# EAGLE design M90E36A (EAGLE 9.6.2)

## Sheet 1 of 2: Main
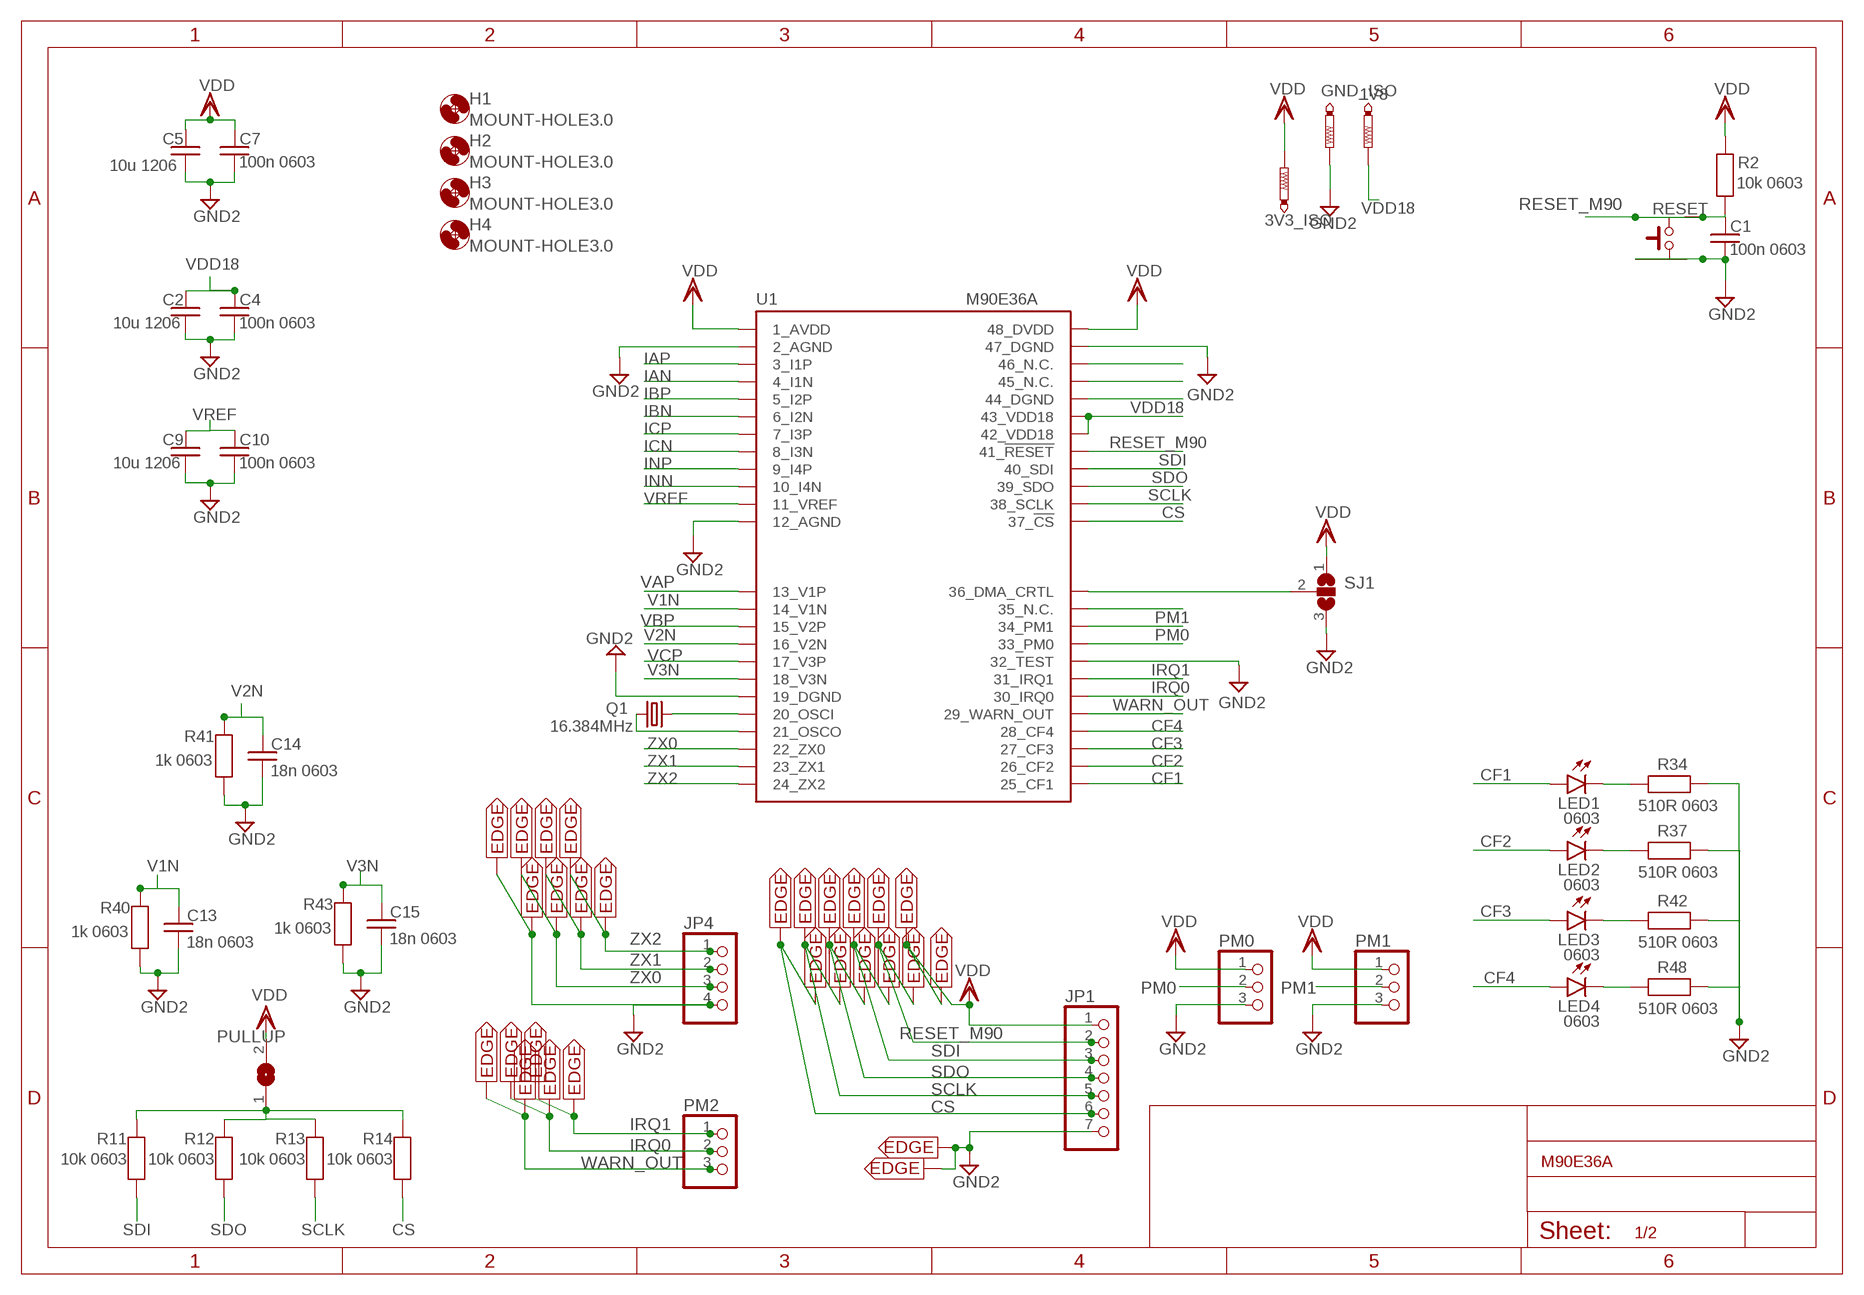
[diagram p0: schematic, sheet 1]

### Parts
1V8  PTR1TP19R  [TP19R]
3V3_ISO  PTR1TP19R  [TP19R]
C1  100n 0603  C0603  [0603_IMPERIAL]
C2  10u 1206  C1206  [1206_IMPERIAL]
C4  100n 0603  C0603  [0603_IMPERIAL]
C5  10u 1206  C1206  [1206_IMPERIAL]
C7  100n 0603  C0603  [0603_IMPERIAL]
C9  10u 1206  C1206  [1206_IMPERIAL]
C10  100n 0603  C0603  [0603_IMPERIAL]
C13  18n 0603  C0603  [0603_IMPERIAL]
C14  18n 0603  C0603  [0603_IMPERIAL]
C15  18n 0603  C0603  [0603_IMPERIAL]
GND_ISO  PTR1TP19R  [TP19R]
H1  MOUNT-HOLE3.0  [3,0]
H2  MOUNT-HOLE3.0  [3,0]
H3  MOUNT-HOLE3.0  [3,0]
H4  MOUNT-HOLE3.0  [3,0]
JP1  PINHD-1X7  [1X07]
JP4  PINHD-1X4  [1X04]
LED1  0603  LEDCHIPLED_0805  [CHIPLED_0805]
LED2  0603  LEDCHIPLED_0805  [CHIPLED_0805]
LED3  0603  LEDCHIPLED_0805  [CHIPLED_0805]
LED4  0603  LEDCHIPLED_0805  [CHIPLED_0805]
PM0  PINHD-1X3  [1X03]
PM1  PINHD-1X3  [1X03]
PM2  PINHD-1X3  [1X03]
PULLUP  SJ  [SJ]
Q1  16.384MHz  CRYSTALHC49UP  [HC49UP]
R2  10k 0603  R0603  [0603_IMPERIAL]
R11  10k 0603  R0603  [0603_IMPERIAL]
R12  10k 0603  R0603  [0603_IMPERIAL]
R13  10k 0603  R0603  [0603_IMPERIAL]
R14  10k 0603  R0603  [0603_IMPERIAL]
R34  510R 0603  R0603  [0603_IMPERIAL]
R37  510R 0603  R0603  [0603_IMPERIAL]
R40  1k 0603  R0603  [0603_IMPERIAL]
R41  1k 0603  R0603  [0603_IMPERIAL]
R42  510R 0603  R0603  [0603_IMPERIAL]
R43  1k 0603  R0603  [0603_IMPERIAL]
R48  510R 0603  R0603  [0603_IMPERIAL]
RESET  TACTILE_SWITCHPTH  [TACTILE_SWITCH_PTH]
SJ1  SJ2W  [SJ_2]
U1  M90E36A  [TQFP-48]
U$1  EDGE  [EDGE]
U$2  EDGE  [EDGE]
U$3  EDGE  [EDGE]
U$4  EDGE  [EDGE]
U$5  EDGE  [EDGE]
U$6  EDGE  [EDGE]
U$7  EDGE  [EDGE]
U$8  EDGE  [EDGE]
U$9  EDGE  [EDGE]
U$10  EDGE  [EDGE]
U$11  EDGE  [EDGE]
U$12  EDGE  [EDGE]
U$13  EDGE  [EDGE]
U$14  EDGE  [EDGE]
U$15  EDGE  [EDGE]
U$16  EDGE  [EDGE]
U$17  EDGE  [EDGE]
U$18  EDGE  [EDGE]
U$19  EDGE  [EDGE]
U$20  EDGE  [EDGE]
U$21  EDGE  [EDGE]
U$22  EDGE  [EDGE]
U$23  EDGE  [EDGE]
U$24  EDGE  [EDGE]
U$25  EDGE  [EDGE]
U$26  EDGE  [EDGE]
U$27  EDGE  [EDGE]
U$28  EDGE  [EDGE]

### Nets
CF1: LED1.A U1.P$25(25_CF1)
CF2: LED2.A U1.P$26(26_CF2)
CF3: LED3.A U1.P$27(27_CF3)
CF4: LED4.A U1.P$28(28_CF4)
CS: JP1.6 R14.P$1 U1.P$37(37_!CS) U$4.P$1 U$25.P$1
GND2: C1.P$1 C2.P$1 C4.P$1 C5.P$1 C7.P$1 C9.P$1 C10.P$1 C13.P$1 C14.P$1 C15.P$1 GND_ISO.TP JP1.7 JP4.4 PM0.3 PM1.3 R34.P$2 R37.P$2 R40.P$1 R41.P$1 R42.P$2 R43.P$1 R48.P$2 RESET.P$1 RESET.P$2 SJ1.3 U1.P$2(2_AGND) U1.P$12(12_AGND) U1.P$19(19_DGND) U1.P$32(32_TEST) U1.P$47(47_DGND) U$6.P$1 U$10.P$1 U$18.P$1 U$28.P$1 ; also sheet 2
IAN: U1.P$4(4_I1N) ; also sheet 2
IAP: U1.P$3(3_I1P) ; also sheet 2
IBN: U1.P$6(6_I2N) ; also sheet 2
IBP: U1.P$5(5_I2P) ; also sheet 2
ICN: U1.P$8(8_I3N) ; also sheet 2
ICP: U1.P$7(7_I3P) ; also sheet 2
INN: U1.P$10(10_I4N) ; also sheet 2
INP: U1.P$9(9_I4P) ; also sheet 2
IRQ0: PM2.2 U1.P$30(30_IRQ0) U$12.P$1 U$20.P$1
IRQ1: PM2.1 U1.P$31(31_IRQ1) U$11.P$1 U$19.P$1
N$1: LED1.C R34.P$1
N$2: LED2.C R37.P$1
N$3: LED3.C R42.P$1
N$4: LED4.C R48.P$1
N$5: Q1.2 U1.P$20(20_OSCI)
N$6: Q1.1 U1.P$21(21_OSCO)
N$9: PULLUP.1 R11.P$2 R12.P$2 R13.P$2 R14.P$2
N$10: SJ1.2 U1.P$36(36_DMA_CRTL)
N$18: U1.P$46(46_N.C.)
N$19: U1.P$44(44_DGND)
N$25: U1.P$45(45_N.C.)
N$32: U1.P$35(35_N.C.)
PM0: PM0.2 U1.P$33(33_PM0)
PM1: PM1.2 U1.P$34(34_PM1)
RESET_M90: C1.P$2 JP1.2 R2.P$1 RESET.P$3 RESET.P$4 U1.P$41(41_!RESET) U$14.P$1 U$27.P$1
SCLK: JP1.5 R13.P$1 U1.P$38(38_SCLK) U$3.P$1 U$24.P$1
SDI: JP1.3 R11.P$1 U1.P$40(40_SDI) U$1.P$1 U$22.P$1
SDO: JP1.4 R12.P$1 U1.P$39(39_SDO) U$2.P$1 U$23.P$1
V1N: C13.P$2 R40.P$2 U1.P$14(14_V1N)
V2N: C14.P$2 R41.P$2 U1.P$16(16_V2N)
V3N: C15.P$2 R43.P$2 U1.P$18(18_V3N)
VAP: U1.P$13(13_V1P) ; also sheet 2
VBP: U1.P$15(15_V2P) ; also sheet 2
VCP: U1.P$17(17_V3P) ; also sheet 2
VDD: 3V3_ISO.TP C5.P$2 C7.P$2 JP1.1 PM0.1 PM1.1 PULLUP.2 R2.P$2 SJ1.1 U1.P$1(1_AVDD) U1.P$48(48_DVDD) U$5.P$1 U$26.P$1 ; also sheet 2
VDD18: 1V8.TP C2.P$2 C4.P$2 U1.P$42(42_VDD18) U1.P$43(43_VDD18)
VREF: C9.P$2 C10.P$2 U1.P$11(11_VREF)
WARN_OUT: PM2.3 U1.P$29(29_WARN_OUT) U$13.P$1 U$21.P$1
ZX0: JP4.3 U1.P$22(22_ZX0) U$9.P$1 U$17.P$1
ZX1: JP4.2 U1.P$23(23_ZX1) U$8.P$1 U$16.P$1
ZX2: JP4.1 U1.P$24(24_ZX2) U$7.P$1 U$15.P$1

## Sheet 2 of 2: Connectors
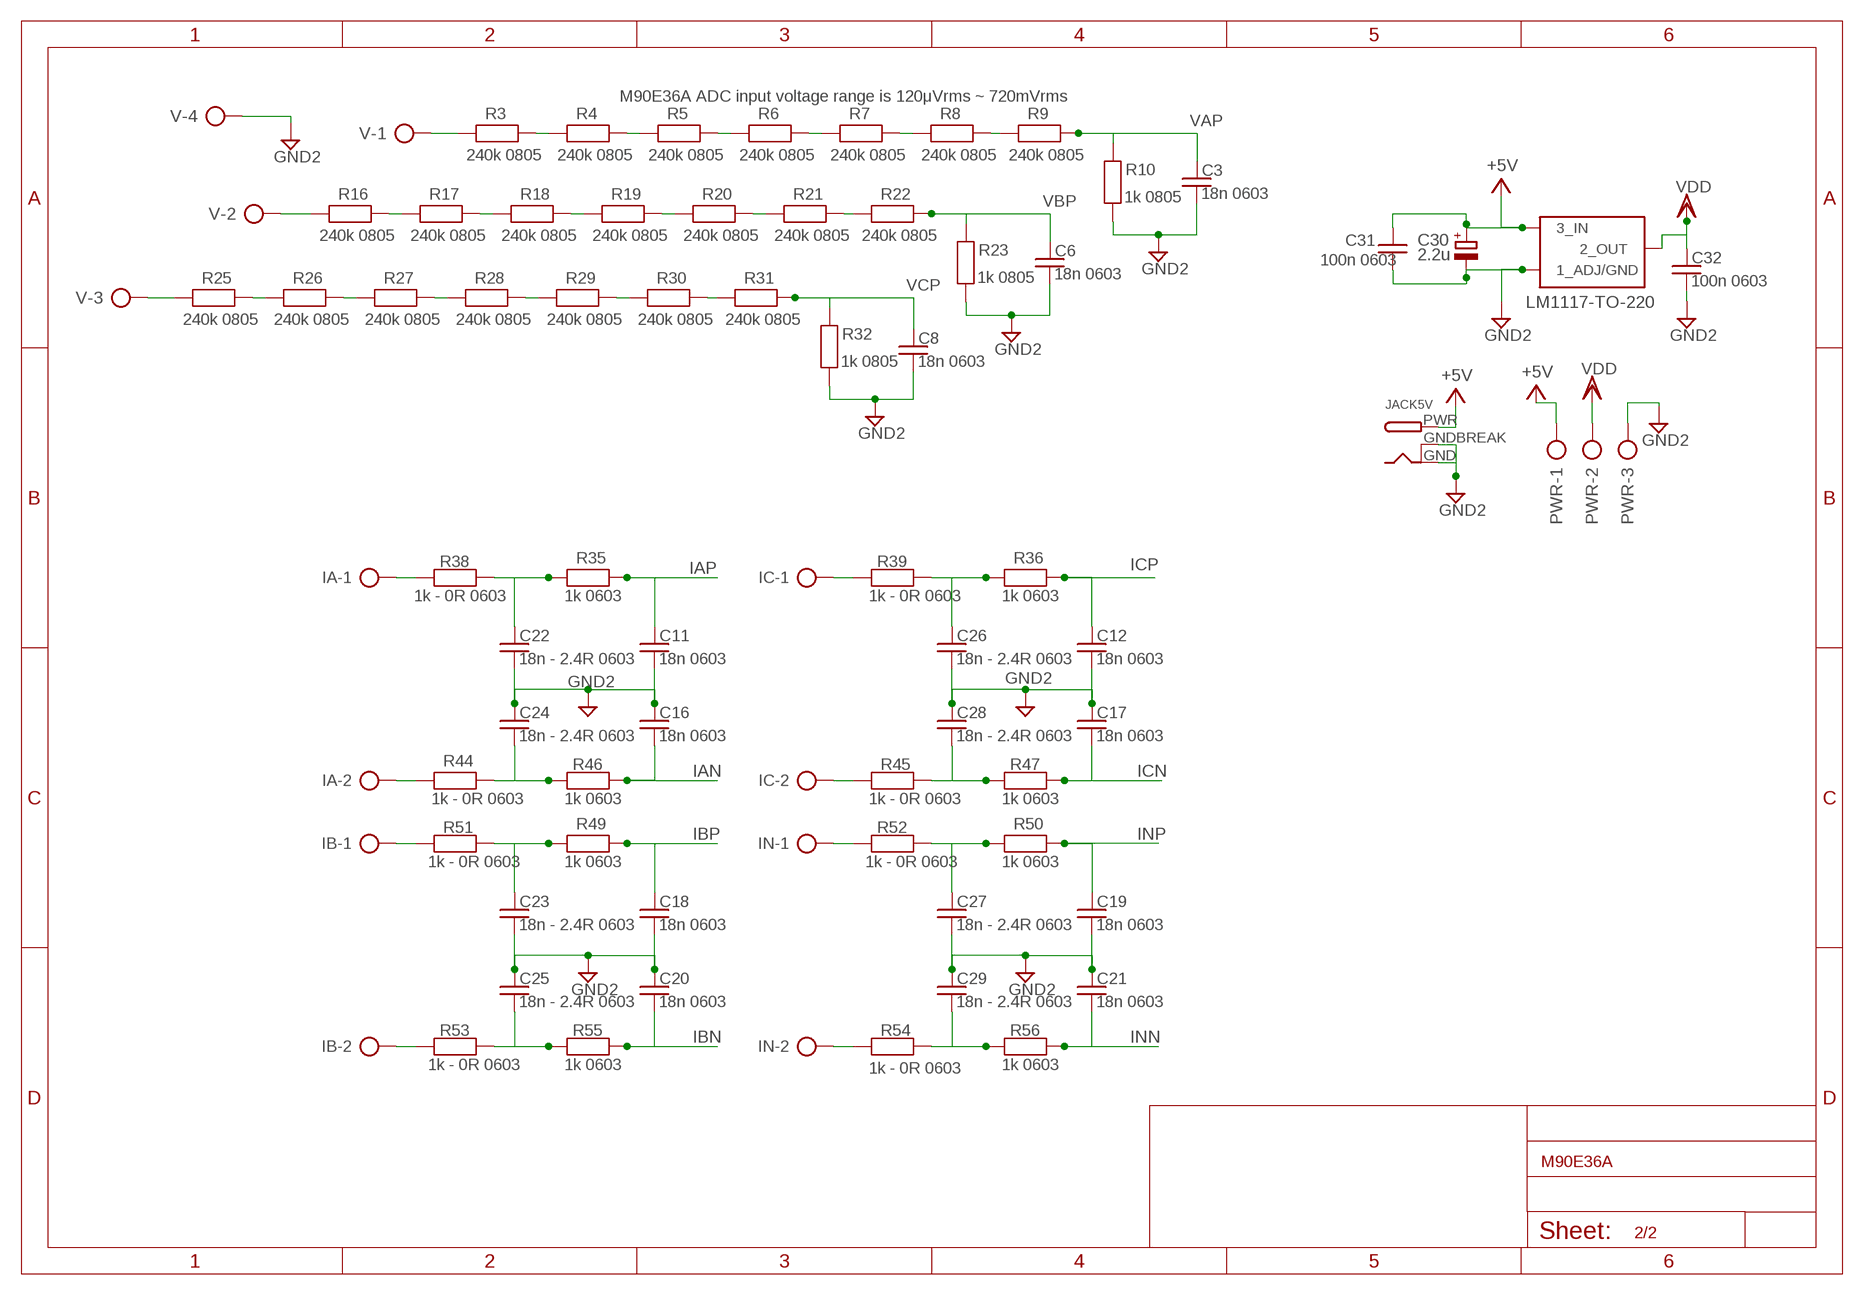
[diagram p1: schematic, sheet 2]

### Parts
C3  18n 0603  C0603  [0603_IMPERIAL]
C6  18n 0603  C0603  [0603_IMPERIAL]
C8  18n 0603  C0603  [0603_IMPERIAL]
C11  18n 0603  C0603  [0603_IMPERIAL]
C12  18n 0603  C0603  [0603_IMPERIAL]
C16  18n 0603  C0603  [0603_IMPERIAL]
C17  18n 0603  C0603  [0603_IMPERIAL]
C18  18n 0603  C0603  [0603_IMPERIAL]
C19  18n 0603  C0603  [0603_IMPERIAL]
C20  18n 0603  C0603  [0603_IMPERIAL]
C21  18n 0603  C0603  [0603_IMPERIAL]
C22  18n - 2.4R 0603  C0603  [0603_IMPERIAL]
C23  18n - 2.4R 0603  C0603  [0603_IMPERIAL]
C24  18n - 2.4R 0603  C0603  [0603_IMPERIAL]
C25  18n - 2.4R 0603  C0603  [0603_IMPERIAL]
C26  18n - 2.4R 0603  C0603  [0603_IMPERIAL]
C27  18n - 2.4R 0603  C0603  [0603_IMPERIAL]
C28  18n - 2.4R 0603  C0603  [0603_IMPERIAL]
C29  18n - 2.4R 0603  C0603  [0603_IMPERIAL]
C30  2.2u  CPOL-EUE2.5-5  [E2,5-5]
C31  100n 0603  C0603  [0603_IMPERIAL]
C32  100n 0603  C0603  [0603_IMPERIAL]
IA  AK500/2  [AK500/2]
IB  AK500/2  [AK500/2]
IC  AK500/2  [AK500/2]
IN  AK500/2  [AK500/2]
JACK5V  DCBARRELPTH  [DCJACK_2MM_PTH]
PWR  AK500/3  [AK500/3]
R3  240k 0805  R0805  [0805_IMPERIAL]
R4  240k 0805  R0805  [0805_IMPERIAL]
R5  240k 0805  R0805  [0805_IMPERIAL]
R6  240k 0805  R0805  [0805_IMPERIAL]
R7  240k 0805  R0805  [0805_IMPERIAL]
R8  240k 0805  R0805  [0805_IMPERIAL]
R9  240k 0805  R0805  [0805_IMPERIAL]
R10  1k 0805  R0805  [0805_IMPERIAL]
R16  240k 0805  R0805  [0805_IMPERIAL]
R17  240k 0805  R0805  [0805_IMPERIAL]
R18  240k 0805  R0805  [0805_IMPERIAL]
R19  240k 0805  R0805  [0805_IMPERIAL]
R20  240k 0805  R0805  [0805_IMPERIAL]
R21  240k 0805  R0805  [0805_IMPERIAL]
R22  240k 0805  R0805  [0805_IMPERIAL]
R23  1k 0805  R0805  [0805_IMPERIAL]
R25  240k 0805  R0805  [0805_IMPERIAL]
R26  240k 0805  R0805  [0805_IMPERIAL]
R27  240k 0805  R0805  [0805_IMPERIAL]
R28  240k 0805  R0805  [0805_IMPERIAL]
R29  240k 0805  R0805  [0805_IMPERIAL]
R30  240k 0805  R0805  [0805_IMPERIAL]
R31  240k 0805  R0805  [0805_IMPERIAL]
R32  1k 0805  R0805  [0805_IMPERIAL]
R35  1k 0603  R0603  [0603_IMPERIAL]
R36  1k 0603  R0603  [0603_IMPERIAL]
R38  1k - 0R 0603  R0603  [0603_IMPERIAL]
R39  1k - 0R 0603  R0603  [0603_IMPERIAL]
R44  1k - 0R 0603  R0603  [0603_IMPERIAL]
R45  1k - 0R 0603  R0603  [0603_IMPERIAL]
R46  1k 0603  R0603  [0603_IMPERIAL]
R47  1k 0603  R0603  [0603_IMPERIAL]
R49  1k 0603  R0603  [0603_IMPERIAL]
R50  1k 0603  R0603  [0603_IMPERIAL]
R51  1k - 0R 0603  R0603  [0603_IMPERIAL]
R52  1k - 0R 0603  R0603  [0603_IMPERIAL]
R53  1k - 0R 0603  R0603  [0603_IMPERIAL]
R54  1k - 0R 0603  R0603  [0603_IMPERIAL]
R55  1k 0603  R0603  [0603_IMPERIAL]
R56  1k 0603  R0603  [0603_IMPERIAL]
U3  LM1117-TO-220  [TO-220]
V  AK500/4  [AK500/4]

### Nets
+5V: C30.+ C31.P$2 JACK5V.PWR PWR.1 U3.3(3_IN)
GND2: C3.P$1 C6.P$1 C8.P$1 C11.P$1 C12.P$1 C16.P$2 C17.P$2 C18.P$1 C19.P$1 C20.P$2 C21.P$2 C22.P$1 C23.P$1 C24.P$2 C25.P$2 C26.P$1 C27.P$1 C28.P$2 C29.P$2 C30.- C31.P$1 C32.P$1 JACK5V.GND JACK5V.GNDBREAK PWR.3 R10.P$1 R23.P$1 R32.P$1 U3.1(1_ADJ/GND) V.4 ; also sheet 1
IAN: C16.P$1 R46.P$2 ; also sheet 1
IAP: C11.P$2 R35.P$2 ; also sheet 1
IBN: C20.P$1 R55.P$2 ; also sheet 1
IBP: C18.P$2 R49.P$2 ; also sheet 1
ICN: C17.P$1 R47.P$2 ; also sheet 1
ICP: C12.P$2 R36.P$2 ; also sheet 1
INN: C21.P$1 R56.P$2 ; also sheet 1
INP: C19.P$2 R50.P$2 ; also sheet 1
N$7: R3.P$2 R4.P$1
N$8: R4.P$2 R5.P$1
N$12: R5.P$2 R6.P$1
N$13: R6.P$2 R7.P$1
N$14: R7.P$2 R8.P$1
N$15: R8.P$2 R9.P$1
N$16: R3.P$1 V.1
N$17: R16.P$2 R17.P$1
N$20: R17.P$2 R18.P$1
N$21: R18.P$2 R19.P$1
N$22: R19.P$2 R20.P$1
N$23: R20.P$2 R21.P$1
N$24: R21.P$2 R22.P$1
N$26: R25.P$2 R26.P$1
N$27: R26.P$2 R27.P$1
N$28: R27.P$2 R28.P$1
N$29: R28.P$2 R29.P$1
N$30: R29.P$2 R30.P$1
N$31: R30.P$2 R31.P$1
N$33: R16.P$1 V.2
N$34: R25.P$1 V.3
N$35: IA.2 R44.P$1
N$36: C24.P$1 R44.P$2 R46.P$1
N$37: IC.1 R39.P$1
N$38: C26.P$2 R36.P$1 R39.P$2
N$39: IA.1 R38.P$2
N$40: C22.P$2 R35.P$1 R38.P$1
N$41: IC.2 R45.P$2
N$42: C28.P$1 R45.P$1 R47.P$1
N$44: IB.1 R51.P$2
N$46: C23.P$2 R49.P$1 R51.P$1
N$48: IB.2 R53.P$2
N$49: C25.P$1 R53.P$1 R55.P$1
N$53: IN.1 R52.P$2
N$54: C27.P$2 R50.P$1 R52.P$1
N$56: IN.2 R54.P$2
N$57: C29.P$1 R54.P$1 R56.P$1
VAP: C3.P$2 R9.P$2 R10.P$2 ; also sheet 1
VBP: C6.P$2 R22.P$2 R23.P$2 ; also sheet 1
VCP: C8.P$2 R31.P$2 R32.P$2 ; also sheet 1
VDD: C32.P$2 PWR.2 U3.2(2_OUT) ; also sheet 1

### Notes on the sheet
- M90E36A ADC input voltage range is 120μVrms ~ 720mVrms

## Library data of the parts
1V8 3V3_ISO GND_ISO = testpad:PTR1: TEST PIN
C1 C3 C4 C6-C8 C10-C29 C31 C32 = IntegratedLibrarySENAI:C0603: Capacitor cerâmico SMD (C0603); TIPO: CAPACITOR
C2 C5 C9 = IntegratedLibrarySENAI:C1206: Capacitor SMD (C1206); TIPO: CAPACITOR
C30 = rcl:CPOL-EU: POLARIZED CAPACITOR, European symbol; SPICEPREFIX: C
H1-H4 = holes:MOUNT-HOLE: MOUNTING HOLE with drill center marker
IA IB IC IN = con-ptr500:AK500/2: CONNECTOR; OC_FARNELL: unknown; OC_NEWARK: unknown
JACK5V = adafruit:DCBARREL: 2.0mm DC Barrel Jack DCJACK_2MM_PTH - Through Hole Jack (4UConnector: 05537)
JP1 = pinhead:PINHD-1X7: PIN HEADER
JP4 = pinhead:PINHD-1X4: PIN HEADER
LED1-LED4 = led:LED: LED OSRAM: - CHIPLED LG R971, LG N971, LY N971, LG Q971, LY Q971, LO R971, LY R971 LH N974, LH R974 LS Q976, LO Q976, LY Q976 LO Q996 - Hyper CHIPLED LW Q18S LB Q993, LB Q99A, LB R99A - SideLED LS A670, LO A670, LY A670, LG A670, LP A670 LB A673, LV A673, LT A673, LW A673 LH A674 LY A675 LS A676, LA A676, LO A676, LY A676, LW A676 LS A679, LY A679, LG A679 - Hyper Micro SIDELED® LS Y876, LA Y876, LO Y876, LY Y876 LT Y87S - SmartLED LW L88C, LW L88S LB L89C, LB L89S, LG L890 LS L89K, LO L89K, LY L89K LS L896, LA L896, LO L896, LY L896 - TOPLED LS T670, LO T670, LY T670, LG T670, LP T670 LSG T670, LSP T670, LSY T670, LOP T670, LYG T670 LG T671, LOG T671, LSG T671 LB T673, LV T673, LT T673, LW T673 LH T674 LS T676, LA T676, LO T676, LY T676, LB T676, LH T676, LSB T676, LW T676 LB T67C, LV T67C, LT T67C, LS T67K, LO T67K, LY T67K, LW E67C LS E67B, LA E67B, LO E67B, LY E67B, LB E67C, LV E67C, LT E67C LW T67C LS T679, LY T679, LG T679 LS T770, LO T770, LY T770, LG T770, LP T770 LB T773, LV T773, LT T773, LW T773 LH T774 LS E675, LA E675, LY E675, LS T675 LS T776, LA T776, LO T776, LY T776, LB T776 LHGB T686 LT T68C, LB T68C - Hyper Mini TOPLED® LB M676 - Mini TOPLED Santana® LG M470 LS M47K, LO M47K, LY M47K Source: http://www.osram.convergy.de LUXEON: - LUMILED® LXK2-PW12-R00, LXK2-PW12-S00, LXK2-PW14-U00, LXK2-PW14-V00 LXK2-PM12-R00, LXK2-PM12-S00, LXK2-PM14-U00 LXK2-PE12-Q00, LXK2-PE12-R00, LXK2-PE12-S00, LXK2-PE14-T00, LXK2-PE14-U00 LXK2-PB12-K00, LXK2-PB12-L00, LXK2-PB12-M00, LXK2-PB14-N00, LXK2-PB14-P00, LXK2-PB14-Q00 LXK2-PR12-L00, LXK2-PR12-M00, LXK2-PR14-Q00, LXK2-PR14-R00 LXK2-PD12-Q00, LXK2-PD12-R00, LXK2-PD12-S00 LXK2-PH12-R00, LXK2-PH12-S00 LXK2-PL12-P00, LXK2-PL12-Q00, LXK2-PL12-R00 Source: www.luxeon.com KINGBRIGHT: KA-3528ASYC Source: www.kingbright.com
PM0 PM1 PM2 = pinhead:PINHD-1X3: PIN HEADER
PULLUP = jumper:SJ: SMD solder JUMPER
PWR = con-ptr500:AK500/3: CONNECTOR; OC_FARNELL: unknown; OC_NEWARK: unknown
Q1 = crystal:CRYSTAL: CRYSTAL; OC_FARNELL: unknown; OC_NEWARK: unknown
R2 R11-R14 R34-R56 = IntegratedLibrarySENAI:R0603: Resistor SMD (R0603); TIPO: RESISTOR
R3-R10 R16-R23 R25-R32 = IntegratedLibrarySENAI:R0805: Resistor SMD R0805; TIPO: RESISTOR
RESET = IntegratedLibrarySENAI:TACTILE_SWITCH: Chave Tactil-Switch; FABRICANTE: METALTEX; PARTNUMBER: A06; TIPO: BOTAO
SJ1 = jumper:SJ2W: SMD solder JUMPER
U1 = IntegratedLibrarySENAI:M90E36A: Poly-Phase High-Performance Energy Metering IC (TQFP48); FABRICANTE: ATMEL; PARTNUMBER: ATM90E36A-AU-Y; TIPO: CIRCUITO INTEGRADO
U3 = IntegratedLibrarySENAI:LM1117-TO-220
U$1-U$28 = IntegratedLibrarySENAI:EDGE
V = con-ptr500:AK500/4: CONNECTOR; OC_FARNELL: unknown; OC_NEWARK: unknown

## Board
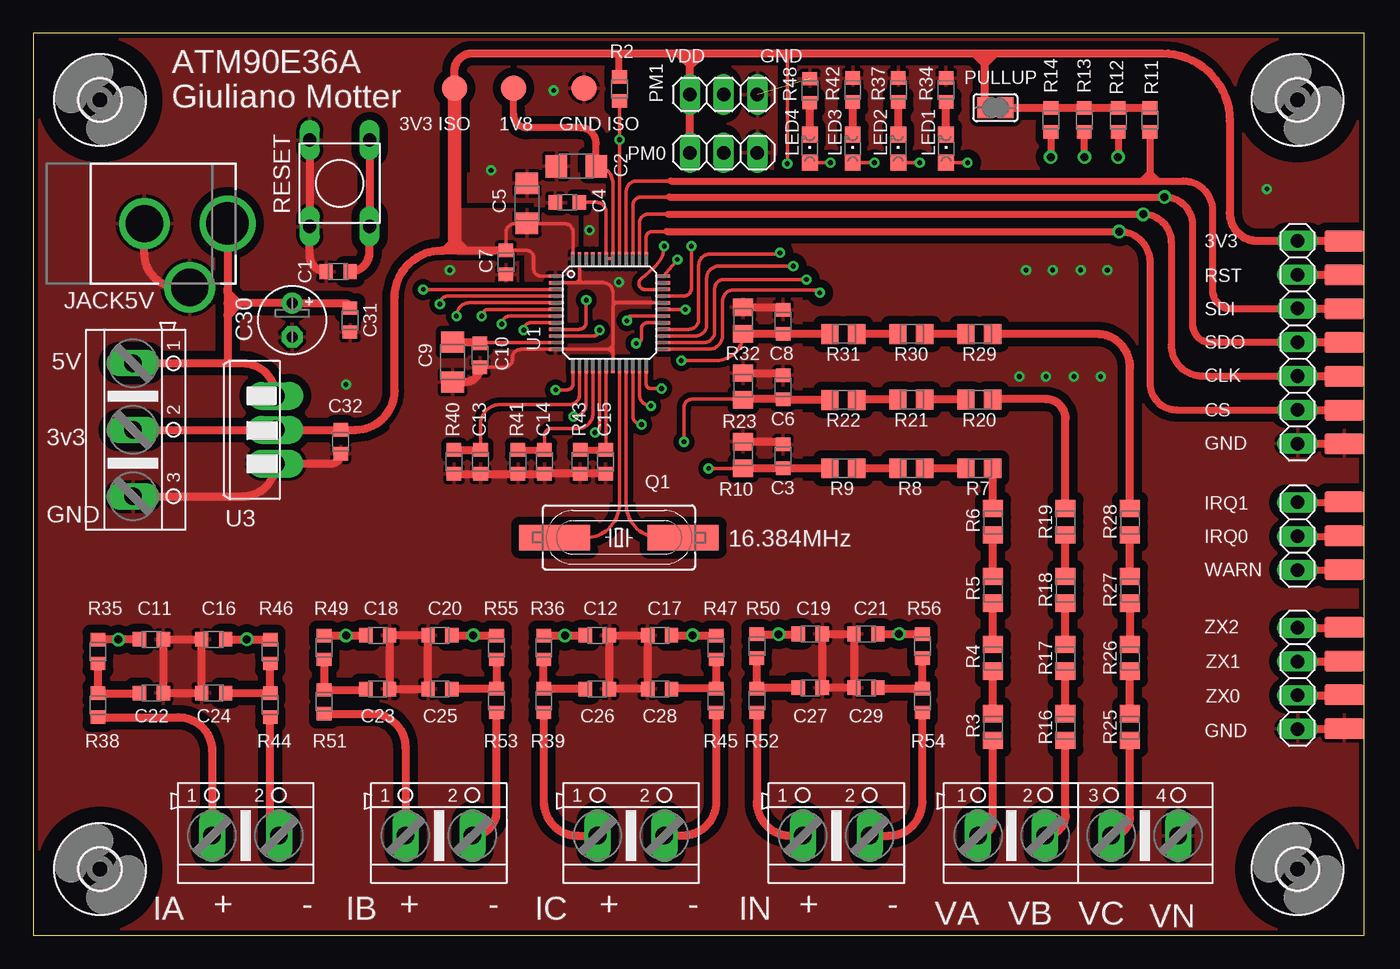
[diagram p2: board, top side]
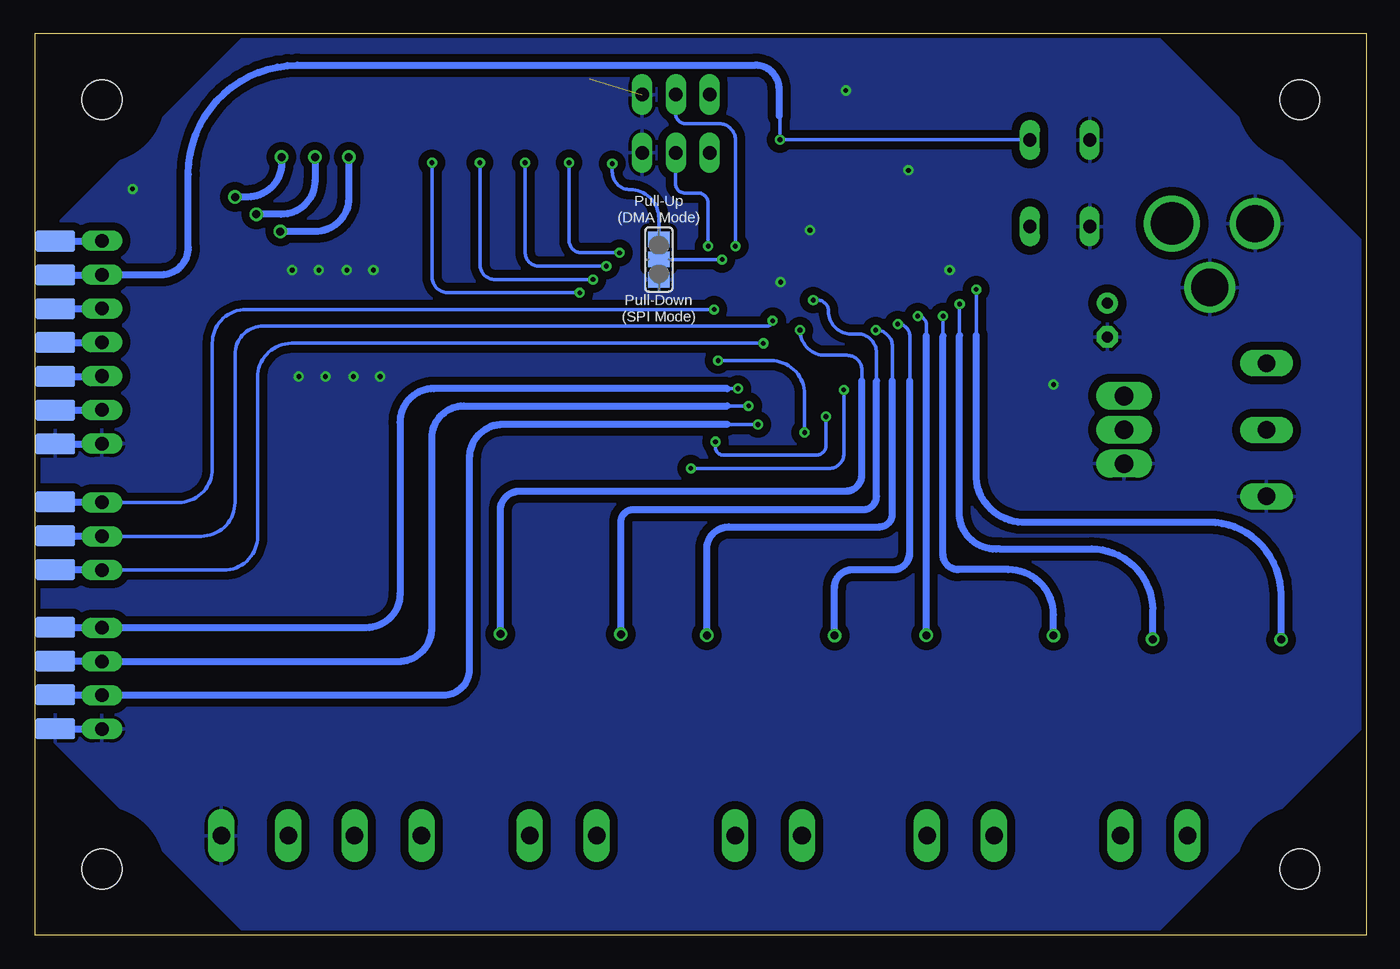
[diagram p3: board, bottom side, seen from below]

Size 100 x 67.8 mm. Coordinates in mm from the lower left corner, seen from the top.
Outline: 100,0 100,67.8 0,67.8 0,0 100,0
Copper layers (1*16): Top 0.035mm / dielectric 1.5mm / Bottom 0.035mm
Design rules "default *": minimum track width 6mil, minimum drill 0.35mm, track to track 6mil, track to pad 6mil, pad to pad 6mil, via to via 6mil, smd to smd 6mil, copper to edge 0mil, drill to drill 6mil, minimum pad ring 10mil, minimum via ring 8mil, stop-mask expansion 4mil, vias tented up to drill 0mil, thermal gap 10mil

### Footprints (pad centres in the part's own frame; a part is rotated, then mirrored left to right if it is on the bottom)
TP19R = smd 1.9 x 1.9: TP 0,0
0603_IMPERIAL = smd 1 x 1.1: P$1 -0.9,0; P$2 0.9,0
1206_IMPERIAL = smd 1.6 x 1.7: P$1 -1.5,0; P$2 1.5,0
E2,5-5 = drill 0.813 pad 1.6: + -1.27,0 | drill 0.813 pad 1.6 octagon: - 1.27,0
3,0 = hole 3: 0,0
AK500/2 = drill 1.321 long: 1 -2.515,0; 2 2.515,0
DCJACK_2MM_PTH = drill 2.8: GND 0,7.35; GNDBREAK 4.8,10.75 | drill 3.2: PWR 0,13.6
1X07 = drill 1.016 long: 1 -7.62,0; 2 -5.08,0; 3 -2.54,0; 4 0,0; 5 2.54,0; 6 5.08,0; 7 7.62,0
1X04 = drill 1.016 long: 1 -3.81,0; 2 -1.27,0; 3 1.27,0; 4 3.81,0
CHIPLED_0805 = smd 1.2 x 1.2: A 0,-1.05; C 0,1.05
1X03 = drill 1.016 long: 1 -2.54,0; 2 0,0; 3 2.54,0
SJ = smd 1.168 x 1.6: 1 -0.762,0; 2 0.762,0
AK500/3 = drill 1.321 long: 1 -5.004,0; 2 0,0; 3 5.004,0
HC49UP = smd 5.334 x 1.93: 1 -4.826,0; 2 4.826,0
0805_IMPERIAL = smd 1.3 x 1.5: P$1 -1,0; P$2 1,0
TACTILE_SWITCH_PTH = drill 1 long: P$1 -3.25,2.25; P$2 3.25,2.25; P$3 -3.25,-2.25; P$4 3.25,-2.25
SJ_2 = smd 1.168 x 1.6: 1 -1.524,0; 2 0,0; 3 1.524,0
TQFP-48 = smd 1 x 0.25: P$1 -4.05,2.75; P$2 -4.05,2.25; P$3 -4.05,1.75; P$4 -4.05,1.25; P$5 -4.05,0.75; P$6 -4.05,0.25; P$7 -4.05,-0.25; P$8 -4.05,-0.75; P$9 -4.05,-1.25; P$10 -4.05,-1.75; P$11 -4.05,-2.25; P$12 -4.05,-2.75; P$25 4.05,-2.75; P$26 4.05,-2.25; P$27 4.05,-1.75; P$28 4.05,-1.25; P$29 4.05,-0.75; P$30 4.05,-0.25; P$31 4.05,0.25; P$32 4.05,0.75; P$33 4.05,1.25; P$34 4.05,1.75; P$35 4.05,2.25; P$36 4.05,2.75 | smd 0.25 x 1: P$13 -2.75,-4.05; P$14 -2.25,-4.05; P$15 -1.75,-4.05; P$16 -1.25,-4.05; P$17 -0.75,-4.05; P$18 -0.25,-4.05; P$19 0.25,-4.05; P$20 0.75,-4.05; P$21 1.25,-4.05; P$22 1.75,-4.05; P$23 2.25,-4.05; P$24 2.75,-4.05; P$37 2.75,4.05; P$38 2.25,4.05; P$39 1.75,4.05; P$40 1.25,4.05; P$41 0.75,4.05; P$42 0.25,4.05; P$43 -0.25,4.05; P$44 -0.75,4.05; P$45 -1.25,4.05; P$46 -1.75,4.05; P$47 -2.25,4.05; P$48 -2.75,4.05
TO-220 = drill 1.4 long: 1 0,-2.54; 2 0,0; 3 0,2.54
EDGE = smd 3 x 1.55: P$1 -0.5,0
AK500/4 = drill 1.321 long: 1 -7.518,0; 2 -2.489,0; 3 2.489,0; 4 7.518,0

### Placement (x,y rotation side)
1V8  36.1,63.68 180 top
3V3_ISO  31.64,63.68 180 top
C1  22.91,49.89 0 top
C2  40.8,57.8 0 top
C3  56.34,36.01 270 top
C4  40.12,55.09 0 top
C5  37.09,55.02 270 top
C6  56.34,41.2 270 top
C7  35.51,50.58 90 top
C8  56.34,46.11 270 top
C9  31.51,43.09 90 top
C10  33.56,43.59 90 top
C11  8.88,22.26 180 top
C12  42.38,22.56 180 top
C13  33.61,35.59 90 top
C14  38.41,35.59 90 top
C15  43.01,35.59 90 top
C16  13.56,22.26 180 top
C17  47.06,22.56 180 top
C18  25.88,22.56 180 top
C19  58.38,22.66 180 top
C20  30.56,22.56 180 top
C21  62.56,22.66 180 top
C22  8.88,18.22 180 top
C23  25.88,18.52 180 top
C24  13.56,18.22 180 top
C25  30.56,18.52 180 top
C26  42.38,18.52 180 top
C27  58.38,18.62 180 top
C28  47.06,18.52 180 top
C29  62.56,18.62 180 top
C30  19.45,46.25 270 top
C31  23.8,46.25 90 top
C32  23.1,37.1 90 top
GND_ISO  41.37,63.68 180 top
H1  95,5 90 top
H2  5,5 90 top
H3  95,62.8 90 top
H4  5,62.8 90 top
IA  15.95,7.5 0 top
IB  30.48,7.5 0 top
IC  44.91,7.5 0 top
IN  60.34,7.5 0 top
JACK5V  1,53.5 270 top
JP1  95,44.58 270 top
JP4  95,19.32 270 top
LED1  68.59,59.12 0 top
LED2  64.99,59.12 0 top
LED3  61.57,59.12 0 top
LED4  58.35,59.12 0 top
PM0  51.87,58.82 0 top
PM1  51.87,63.2 0 top
PM2  95,30 270 top
PULLUP  72.3,62.2 180 top
PWR  7.5,38 270 top
Q1  44,29.9 180 top
R2  44.05,63.62 90 top
R3  72.11,15.66 90 top
R4  72.11,20.87 90 top
R5  72.11,25.98 90 top
R6  72.11,31.09 90 top
R7  71.08,35.11 180 top
R8  65.97,35.11 180 top
R9  60.86,35.11 180 top
R10  53.34,36.11 270 top
R11  83.9,61.29 90 top
R12  81.52,61.29 90 top
R13  78.96,61.29 90 top
R14  76.46,61.29 90 top
R16  77.56,15.66 90 top
R17  77.56,20.87 90 top
R18  77.56,25.98 90 top
R19  77.56,31.09 90 top
R20  71.08,40.26 180 top
R21  65.97,40.26 180 top
R22  60.86,40.25 180 top
R23  53.34,41.26 270 top
R25  82.41,15.66 90 top
R26  82.41,20.87 90 top
R27  82.41,25.98 90 top
R28  82.41,31.09 90 top
R29  71.08,45.21 180 top
R30  65.97,45.21 180 top
R31  60.86,45.21 180 top
R32  53.34,46.21 270 top
R34  68.59,63.53 90 top
R35  4.86,21.34 90 top
R36  38.36,21.64 90 top
R37  64.99,63.53 90 top
R38  4.86,17.3 270 top
R39  38.36,17.66 90 top
R40  31.61,35.59 90 top
R41  36.41,35.59 90 top
R42  61.57,63.53 90 top
R43  41.1,35.6 90 top
R44  17.81,17.3 90 top
R45  51.31,17.66 270 top
R46  17.81,21.34 90 top
R47  51.31,21.64 90 top
R48  58.35,63.48 90 top
R49  21.86,21.64 90 top
R50  54.36,21.74 90 top
R51  21.86,17.56 270 top
R52  54.36,17.66 270 top
R53  34.81,17.66 270 top
R54  66.81,17.66 270 top
R55  34.81,21.64 90 top
R56  66.81,21.74 90 top
RESET  23.02,56.53 90 top
SJ1  53.15,50.8 270 bottom
U1  43.3,46.8 0 top
U3  18.2,38 0 top
U$1  99,47.1 0 top
U$2  99,44.56 0 top
U$3  99,42.02 0 top
U$4  99,39.48 0 top
U$5  99,52.18 0 top
U$6  99,36.94 0 top
U$7  99,23.16 0 top
U$8  99,20.62 0 top
U$9  99,18.08 0 top
U$10  99,15.54 0 top
U$11  99,32.58 0 top
U$12  99,30.04 0 top
U$13  99,27.5 0 top
U$14  99,49.64 0 top
U$15  98,23.16 0 bottom
U$16  98,20.62 0 bottom
U$17  98,18.08 0 bottom
U$18  98,15.54 0 bottom
U$19  98,32.58 0 bottom
U$20  98,30.04 0 bottom
U$21  98,27.5 0 bottom
U$22  98,47.1 0 bottom
U$23  98,44.56 0 bottom
U$24  98,42.02 0 bottom
U$25  98,39.48 0 bottom
U$26  98,52.18 0 bottom
U$27  98,49.64 0 bottom
U$28  98,36.94 0 bottom
V  78.51,7.5 0 top

### Tracks (layer width: path | path; a pad name or v marks a point on that pad's centre or on a via)
+5V
  Top 0.61: PWR.1 14.6,43 | 14.6,43 15.74,43 arc-90 U3.3 | JACK5V.PWR 14.6,48.6 | 14.6,48.6 14.6,47.5 | 14.6,47.5 14.6,46.6 | 14.6,46.6 14.6,43 | 15.4,47.52 C30.+ 23.43,47.52 arc-90 C31.P$2 | 15.4,47.52 14.62,47.52 arc90 14.6,47.5 | 15.4,47.52 14.6,48.32 14.6,48.6 | 15.4,47.52 15.4,47.4 14.6,46.6
CF1  (via drill 0.35)
  Top 0.254: U1.P$25 50.75,44.05 arc90 51.8,45.1 51.8,47.7 arc-90 52.6,48.5 58.9,48.5 arc-90 v59.1,48.3 | v70.2,58.07 LED1.A
  Bottom 0.254: v59.1,48.3 68.96,48.3 arc90 70.2,49.54 v70.2,58.07
CF2  (via drill 0.35)
  Top 0.254: U1.P$26 50.35,44.55 arc90 51.2,45.4 51.2,48.6 arc-90 51.9,49.3 v58.1,49.3 | v66.6,58.07 LED2.A
  Bottom 0.254: v58.1,49.3 65.46,49.3 arc90 66.6,50.44 v66.6,58.07
CF3  (via drill 0.35)
  Top 0.254: U1.P$27 49.75,45.05 arc90 50.6,45.9 50.6,49.4 arc-90 51.5,50.3 v57.1,50.3 | v63.2,58.07 LED3.A
  Bottom 0.254: v57.1,50.3 62.16,50.3 arc90 63.2,51.34 v63.2,58.07
CF4  (via drill 0.35)
  Top 0.254: U1.P$28 49.25,45.55 arc90 50,46.3 50,50.36 arc-90 50.84,51.2 56,51.2 v56.1,51.3 | v59.9,58.07 LED4.A
  Bottom 0.254: v56.1,51.3 58.96,51.3 arc90 59.9,52.24 v59.9,58.07
CS  (via drill 0.6)
  Top 0.254: 83.9,41.5 arc90 85.9,39.5 | U1.P$37 46.05,52.45 arc-90 46.5,52.9 47.6,52.9
  Top 0.508: 47.6,52.9 v81.6,52.9 arc-90 83.9,50.6 83.9,41.5 arc90 85.9,39.5 JP1.6 | R14.P$1 v76.46,58.51 arc90 v76.45,58.5
  Top 0.61: JP1.6 98.98,39.5 arc-90 U$25.P$1
  Bottom 0.508: v76.45,58.5 76.45,55.44 arc90 78.99,52.9 v81.6,52.9 | U$25.P$1 95.02,39.48 JP1.6
GND2  (via drill 0.35)  (1 unrouted)
  Top 0.2: 43.55,48.31 43.55,47.8 | 43.55,47.8 43.55,47.55 | 43.55,47.55 43.55,47.3 43.8,47.55 | 43.55,44.35 43.55,44.05 | 43.8,47.55 43.55,47.55 | 41.05,49.35 41.05,49.05 | 40.75,49.05 41.05,49.35 | 41.35,49.05 41.05,49.35 | 43.8,47.55 43.55,47.8 | 43.25,44.05 43.25,44 43.55,43.7
  Top 0.254: C10.P$1 arc-90 C10.P$1 35.4,42.7 arc90 36,43.3 36,43.4 arc-90 36.65,44.05 U1.P$12 43.25,44.05 | U1.P$2 40.75,49.05 41.05,49.05 41.35,49.05 42.81,49.05 arc-90 43.55,48.31 | 43.55,47.3 43.55,44.35 43.25,44.05 | U1.P$19 43.55,43.7 43.55,44.05 43.25,44.05 | U1.P$32 43.8,47.55 | U1.P$47 41.05,49.35
  Top 0.61: R40.P$1 C13.P$1 R41.P$1 C14.P$1 R43.P$1 C15.P$1 | C9.P$1 32.46,41.59 arc90 C10.P$1 | PWR.3 15.74,33 arc90 U3.1 22.36,35.46 arc90 C32.P$1 | RESET.P$2 RESET.P$1 20.77,51.13 arc90 C1.P$1 | JACK5V.GNDBREAK 10.89,48.7 arc-90 8.35,51.24 JACK5V.GND | JP1.7 98.98,36.96 arc-90 U$28.P$1 | JP4.4 98.97,15.51 arc90 U$18.P$1 | R10.P$1 56.14,37.11 arc-90 C3.P$1 | R23.P$1 56.18,42.26 arc-90 C6.P$1 | R32.P$1 56.14,47.21 arc-90 C8.P$1 | C11.P$1 C16.P$2 C24.P$2 C22.P$1 C11.P$1 | C23.P$1 C25.P$2 C20.P$2 C18.P$1 C23.P$1 | C26.P$1 C12.P$1 C17.P$2 C28.P$2 C26.P$1 | C19.P$1 C21.P$2 C29.P$2 C27.P$1 C19.P$1
  Bottom 0.508: U$28.P$1 95.02,36.94 JP1.7 | U$18.P$1 95.03,15.54 JP4.4
  other vias: 74.6,50 92.7,56.1 39.1,63.5 34.4,57.5 31.3,50 41.8,53 23.5,41.4 44,49.1 76.6,50 78.7,50 80.7,50 74.1,42 76.1,42 78.2,42 80.2,42
  pour Top (isolate 0.61, rank 2): 99.5,0.5 0.5,0.5 0.5,67.3 99.5,67.3
  pour Bottom (isolate 0.61, rank 2): 99.5,15.5 84.5,0.5 15.5,0.5 0.5,15.5 0.5,52.3 15.5,67.3 84.5,67.3 99.5,52.3
  pour Top (isolate 0.406, rank 2): 26.9,57.2 26.9,32.7 57.7,32.7 57.7,57.2
IAN  (via drill 0.35, 0.6)
  Top 0.254: U1.P$4 31.15,48.05 arc90 v30.55,47.45
  Top 0.61: C16.P$1 v16.05,22.26 17.79,22.26 arc-90 R46.P$2
  Bottom 0.254: 30.55,45.1 v30.55,47.45
  Bottom 0.508: v16.05,22.26 16.05,24.46 arc-90 20.64,29.05 27.56,29.05 arc90 30.55,31.44 30.55,45.1
IAP  (via drill 0.35, 0.6)
  Top 0.254: U1.P$3 v29.3,48.55
  Top 0.61: C11.P$2 arc-90 7.96,22.24 v6.4,22.24 R35.P$2
  Bottom 0.254: 29.3,45.1 v29.3,48.55
  Bottom 0.508: v6.4,22.24 6.4,25.61 arc-90 11.84,31.05 25.51,31.05 arc90 29.3,34.39 29.3,45.1
IBN  (via drill 0.35, 0.6)
  Top 0.254: U1.P$6 34.2,47.05 arc90 v33.7,46.55
  Top 0.61: C20.P$1 v33.05,22.56 34.79,22.56 arc-90 R55.P$2
  Bottom 0.254: 33.05,45.05 33.05,45.9 arc-90 v33.7,46.55
  Bottom 0.508: v33.05,22.56 33.05,45.05
IBP  (via drill 0.35, 0.6)
  Top 0.254: U1.P$5 32.8,47.55 arc90 v31.8,46.55
  Top 0.61: R49.P$2 v23.5,22.54 24.96,22.54 arc90 C18.P$2
  Bottom 0.254: 31.8,45.05 v31.8,46.55
  Bottom 0.508: 31.8,45.05 31.8,28.63 arc-90 30.67,27.5 26.9,27.5 arc90 23.5,24.1 v23.5,22.54
ICN  (via drill 0.35, 0.6)
  Top 0.254: U1.P$8 37.4,46.05 arc90 v36.85,45.5
  Top 0.61: C17.P$1 v49.55,22.56 51.29,22.56 arc-90 R47.P$2
  Bottom 0.254: 35.6,41.7 35.6,44.25 arc-90 v36.85,45.5
  Bottom 0.508: v49.55,22.56 49.55,29.05 arc90 47.9,30.7 36.6,30.7 arc-90 35.6,31.7 35.6,41.7
ICP  (via drill 0.35, 0.6)
  Top 0.254: U1.P$7 35.8,46.55 arc90 v35.2,45.95
  Top 0.61: R36.P$2 v39.95,22.54 41.46,22.54 arc90 C12.P$2
  Bottom 0.254: 34.3,41.7 34.3,45.05 arc-90 v35.2,45.95
  Bottom 0.508: v39.95,22.54 39.95,26.15 arc90 38.6,27.5 35.54,27.5 arc-90 34.3,28.74 34.3,41.7
INN  (via drill 0.35, 0.6)
  Top 0.254: U1.P$10 42.1,45.05 arc90 v42.55,45.5
  Top 0.61: C21.P$1 v65.05,22.66 66.79,22.66 arc-90 R56.P$2
  Bottom 0.254: 37.9,41.7 37.9,42.5 arc-90 39,43.6 40.65,43.6 arc90 v42.55,45.5
  Bottom 0.508: v65.05,22.66 65.05,31.95 arc90 63.6,33.4 39.1,33.4 arc-90 37.9,34.6 37.9,41.7
INP  (via drill 0.35, 0.6)
  Top 0.254: U1.P$9 41,45.55 arc90 41.55,46.1 v41.55,47.75
  Top 0.61: R50.P$2 v56,22.64 57.46,22.64 arc90 C19.P$2
  Bottom 0.254: 36.8,41.7 36.8,43.8 arc-90 38.2,45.2 38.7,45.2 arc90 40.4,46.9 arc-90 41.25,47.75 v41.55,47.75
  Bottom 0.508: v56,22.64 56,31.1 arc90 55.1,32 37.8,32 arc-90 36.8,33 36.8,41.7
IRQ0  (via drill 0.35)
  Top 0.254: U1.P$30 44.95,46.55 arc90 v44.6,46.2
  Top 0.508: PM2.2 99,30 U$20.P$1
  Bottom 0.254: PM2.2 87.54,30 arc-90 85,32.54 85,43.66 arc90 82.86,45.8 45,45.8 arc-90 v44.6,46.2
  Bottom 0.508: U$20.P$1 95.04,30.04 PM2.2
IRQ1  (via drill 0.35)
  Top 0.254: U1.P$31 48.95,47.05 arc-90 v49,47.05
  Top 0.508: PM2.1 99,32.54 U$19.P$1
  Bottom 0.254: v49,47.05 84.16,47.05 arc-90 86.7,44.51 86.7,35.08 arc90 89.24,32.54 PM2.1
  Bottom 0.508: U$19.P$1 95.04,32.58 PM2.1
N$1
  Top 0.61: LED1.C R34.P$1
N$2
  Top 0.61: LED2.C R37.P$1
N$3
  Top 0.61: LED3.C R42.P$1
N$4
  Top 0.61: LED4.C R48.P$1
N$5
  Top 0.254: U1.P$20 44.05,32.44 arc-90 41.51,29.9 Q1.2
N$6
  Top 0.254: U1.P$21 44.55,32.44 arc90 47.09,29.9 Q1.1
N$7
  Top 0.61: R3.P$2 R4.P$1
N$8
  Top 0.61: R4.P$2 R5.P$1
N$9
  Top 0.61: PULLUP.1 R14.P$2 R13.P$2 R12.P$2 R11.P$2
N$10  (via drill 0.35)
  Top 0.254: U1.P$36 v48.4,50.8
  Bottom 0.254: v48.4,50.8 SJ1.2
N$12
  Top 0.61: R5.P$2 R6.P$1
N$13
  Top 0.61: R6.P$2 72.11,35.08 arc90 R7.P$1
N$14
  Top 0.61: R7.P$2 R8.P$1
N$15
  Top 0.61: R8.P$2 R9.P$1
N$16
  Top 0.61: V.1 arc90 72.11,8.62 R3.P$1
N$17
  Top 0.61: R16.P$2 R17.P$1
N$20
  Top 0.61: R17.P$2 R18.P$1
N$21
  Top 0.61: R18.P$2 R19.P$1
N$22
  Top 0.61: R19.P$2 77.56,38.84 arc90 76.1,40.3 72.12,40.3 arc90 R20.P$1
N$23
  Top 0.61: R20.P$2 R21.P$1
N$24
  Top 0.61: R21.P$2 R22.P$1 arc90 R22.P$1
N$26
  Top 0.61: R25.P$2 R26.P$1
N$27
  Top 0.61: R27.P$1 R26.P$2
N$28
  Top 0.61: R27.P$2 R28.P$1
N$29
  Top 0.61: R28.P$2 82.41,42.69 arc90 79.9,45.2 R29.P$1 arc-90 R29.P$1
N$30
  Top 0.61: R29.P$2 R30.P$1
N$31
  Top 0.61: R30.P$2 R31.P$1
N$33
  Top 0.61: V.2 arc90 77.56,9.04 R16.P$1
N$34
  Top 0.61: V.3 arc90 82.41,8.91 R25.P$1
N$35
  Top 0.61: IA.2 arc-90 17.81,8.15 R44.P$1
N$36
  Top 0.61: C24.P$1 17.79,18.22 arc-90 R44.P$2 R46.P$1
N$37
  Top 0.61: R39.P$1 38.36,10.04 arc90 40.9,7.5 IC.1
N$38
  Top 0.61: R36.P$1 R39.P$2 41.44,18.56 arc-90 C26.P$2
N$39
  Top 0.61: R38.P$2 10.89,16.4 arc-90 13.44,13.86 IA.1
N$40
  Top 0.61: R35.P$1 R38.P$1 7.96,18.2 arc90 C22.P$2
N$41
  Top 0.61: R45.P$2 51.31,10.04 arc-90 48.77,7.5 IC.2
N$42
  Top 0.61: R47.P$1 R45.P$1 48,18.56 arc90 C28.P$1
N$44
  Top 0.61: R51.P$2 25.43,16.66 arc-90 27.96,14.12 IB.1
N$46
  Top 0.61: R49.P$1 R51.P$1 24.92,18.46 arc90 C23.P$2
N$48
  Top 0.61: IB.2 arc90 34.81,9.31 R53.P$2
N$49
  Top 0.61: R55.P$1 R53.P$1 arc-90 34.77,18.52 C25.P$1
N$53
  Top 0.61: R52.P$2 54.36,10.04 arc90 56.9,7.5 IN.1
N$54
  Top 0.61: R50.P$1 R52.P$1 arc-90 54.42,18.62 C27.P$2
N$56
  Top 0.61: IN.2 64.27,7.5 arc90 66.81,10.04 R54.P$2
N$57
  Top 0.61: C29.P$1 arc90 63.52,18.56 R54.P$1 R56.P$1
PM0  (via drill 0.35)
  Top 0.254: U1.P$33 48.85,48.05 arc90 49.45,48.65 v49.45,51.8
  Bottom 0.254: v49.45,51.8 49.45,55.05 arc-90 50.2,55.8 51.2,55.8 arc90 51.9,56.5 51.9,58.79 arc90 PM0.2
PM1  (via drill 0.35)
  Top 0.254: U1.P$34 45.95,48.55 arc-143 45.68,49.35 46.65,50.2 46.8,50.35 arc45 v47.4,51.8
  Bottom 0.254: v47.4,51.8 47.4,59.8 arc-90 48.6,61 51.1,61 arc90 51.9,61.8 51.9,63.17 arc90 PM1.2
RESET_M90  (via drill 0.35)
  Top 0.254: U1.P$41 v44.05,59.8 R2.P$1
  Top 0.61: RESET.P$4 RESET.P$3 25.27,51.35 arc-90 C1.P$2 | JP1.2 98.98,49.66 arc-90 U$27.P$1
  Bottom 0.254: RESET.P$4 arc-90 25.29,59.8 v44.05,59.8 44.05,61.55 arc-90 44.1,61.6
  Bottom 0.508: 44.1,61.6 44.1,63.6 arc-90 45.9,65.4 80.3,65.4 arc-90 88.5,57.2 88.5,51.7 arc90 90.54,49.66 JP1.2 95.02,49.64 U$27.P$1
SCLK  (via drill 0.6)
  Top 0.254: 85.5,44.38 arc90 87.84,42.04 | U1.P$38 45.55,53.55 arc-90 46.2,54.2 47.7,54.2
  Top 0.508: 47.7,54.2 v83.4,54.2 arc-90 85.5,52.1 85.5,44.38 arc90 87.84,42.04 JP1.5 | v78.99,58.5 78.99,60.39 R13.P$1
  Top 0.61: JP1.5 98.98,42.04 arc-90 U$24.P$1
  Bottom 0.508: v78.99,58.5 78.99,56.74 arc90 81.53,54.2 v83.4,54.2 | U$24.P$1 95.02,42.02 JP1.5
SDI
  Top 0.254: U1.P$40 44.55,55.91 arc-90 45.34,56.7 47.9,56.7 | 88.6,48.5 arc90 90,47.1 94.98,47.1 arc90 JP1.3
  Top 0.508: 47.9,56.7 83.3,56.7 | 83.3,56.7 83.9,56.7 | 83.9,56.7 84.5,56.7 | 84.5,56.7 86.4,56.7 arc-90 88.6,54.5 88.6,48.5 arc90 90,47.1 arc-90 90.02,47.12 JP1.3 | 83.9,56.7 83.9,57.3 | R11.P$1 83.9,57.3 | 83.3,56.7 83.9,57.3 | 83.9,57.3 84.5,56.7
  Top 0.61: JP1.3 98.98,47.12 arc-90 U$22.P$1
  Bottom 0.508: U$22.P$1 95.02,47.1 JP1.3
SDO  (via drill 0.6)
  Top 0.254: U1.P$39 45.05,54.85 arc-90 45.7,55.5 47.8,55.5 | 88.44,44.58 arc-90 87.1,45.92
  Top 0.508: 47.8,55.5 v85,55.5 arc-90 87.1,53.4 87.1,45.92 arc90 88.44,44.58 JP1.4 | R12.P$1 81.52,58.52 v81.5,58.5
  Top 0.61: JP1.4 98.98,44.58 arc-90 U$23.P$1
  Bottom 0.508: v81.5,58.5 81.5,58.04 arc90 84.04,55.5 v85,55.5 | U$23.P$1 95.02,44.56 JP1.4
V1N
  Top 0.254: U1.P$14 41.05,40.65 arc-90 40.3,39.9 35.1,39.9 arc90 33.6,38.4 C13.P$2 arc90 C13.P$2
  Top 0.61: R40.P$2 C13.P$2
V2N
  Top 0.254: U1.P$16 42.05,39.25 arc-90 40.9,38.1 38.95,38.1 arc90 38.4,37.55 C14.P$2
  Top 0.508: R41.P$2 C14.P$2
V3N
  Top 0.254: U1.P$18 43.05,36.55
  Top 0.508: R43.P$2 C15.P$2 | C15.P$2 43.05,36.55 | C15.P$2
VAP  (via drill 0.35)
  Top 0.254: U1.P$13 40.55,41.45 arc-90 40.1,41 v39.25,41 | v50.75,35.1 52.93,35.1 arc90 R10.P$2
  Top 0.61: R9.P$2 C3.P$2 R10.P$2
  Bottom 0.254: v39.25,41 39.25,36.2 arc90 40.35,35.1 v50.75,35.1
VBP  (via drill 0.35)
  Top 0.254: U1.P$15 41.55,39.95 arc-90 v40.6,39 | R23.P$2 arc90 52.9,40.3 49.5,40.3 arc90 48.9,39.7 v48.9,37.1
  Top 0.61: R22.P$2 56.39,40.25 arc-90 C6.P$2 52.98,40.3 arc90 R23.P$2
  Bottom 0.254: v40.6,39 40.6,36.8 arc90 41.3,36.1 48.3,36.1 arc90 48.9,36.7 v48.9,37.1
VCP  (via drill 0.35)
  Top 0.254: U1.P$17 42.55,38.15 arc-90 v42.2,37.8 | v48.7,43.2 51.33,43.2 arc90 R32.P$2
  Top 0.61: R31.P$2 C8.P$2 R32.P$2
  Bottom 0.254: v42.2,37.8 42.2,40.66 arc-90 44.74,43.2 v48.7,43.2
VDD  (via drill 0.35)
  Top 0.254: U1.P$1 38.15,49.55 arc-90 37.6,50.1 37.6,50.9 arc90 37,51.5 35.53,51.5 arc90 C7.P$2 35.51,52.8 arc-90 36.21,53.5 37.11,53.5 | U1.P$48 40.55,52.85 arc90 39.9,53.5 37.11,53.5 | 37.11,53.5 arc-90 C5.P$2 | v56.65,58 56.65,65.6 | 56.65,66.3 56.65,65.6 | 56.65,65.6 arc90 55.95,66.3 55.5,66.3 | 56.65,65.6 arc-90 57.35,66.3 57.85,66.3
  Top 0.508: R2.P$2 arc-90 44,64.57 44,66.3
  Top 0.61: PWR.2 U3.2 C32.P$2 24.21,38 arc90 27.15,40.94 27.15,47.94 arc-90 30.69,51.48 30.9,51.48 | C7.P$2 32.5,51.48 | 32.5,51.48 31.7,51.48 | 31.7,51.48 30.9,51.48 | 31.64,52.22 31.64,51.54 arc90 31.7,51.48 | 30.9,51.48 31.64,52.22 | 31.64,52.22 31.64,52.34 32.5,51.48 | 3V3_ISO.TP 31.64,64.94 arc-90 33,66.3 44,66.3 48.48,66.3 | 48.48,66.3 49.4,66.3 | 49.4,66.3 50.3,66.3 | 49.33,65.45 PM1.1 PM0.1 | 49.38,65.4 49.38,66.28 arc-90 49.4,66.3 | 49.38,65.4 49.33,65.45 | 49.33,65.45 48.48,66.3 | 49.38,65.4 49.4,65.4 50.3,66.3 | 50.3,66.3 55.5,66.3 56.65,66.3 57.85,66.3 70.7,66.3 | 70.7,66.3 71.5,66.3 | 71.5,66.3 72.3,66.3 | 72.3,66.3 84.8,66.3 arc-90 89.9,61.2 89.9,54.3 arc90 92,52.2 JP1.1 98.98,52.2 arc-90 U$26.P$1 | PULLUP.2 arc-90 71.5,62.24 71.5,65.5 | 71.5,66.3 71.5,65.5 | 71.5,65.5 70.7,66.3 | 71.5,65.5 72.3,66.3
  Top 1.016: 3V3_ISO.TP 31.64,52.34
  Bottom 0.254: SJ1.1 53.15,53.9 arc-90 55.3,56.05 arc90 56.65,57.4 v56.65,58
  Bottom 0.508: U$26.P$1 95.02,52.18 JP1.1
  pour Top (isolate 0.406): 37,49.2 40.9,49.2 40.9,54.6 31.9,54.6 31.9,51.2 37,51.2
VDD18
  Top 0.254: C4.P$2 arc-90 C4.P$2 42.3,55.1 arc-90 43.05,54.35 U1.P$43 U1.P$42 43.55,52.4 43.55,56.55 arc90 C2.P$2
  Top 0.508: C2.P$2 42.3,59.5 arc90 41.1,60.7 37.1,60.7 arc-90 36.1,61.7 1V8.TP
VREF
  Top 0.254: U1.P$11 33.5,44.55 arc-90 33.46,44.59
  Top 0.61: C9.P$2 33.46,44.59 arc-90 C10.P$2
WARN_OUT  (via drill 0.35)
  Top 0.254: U1.P$29 46.15,46.05 arc90 45.7,45.6 45.7,44.9 arc-90 v45.3,44.5
  Top 0.508: PM2.3 99,27.46 U$21.P$1
  Bottom 0.254: PM2.3 85.84,27.46 arc-90 83.3,30 83.3,41.96 arc90 80.76,44.5 v45.3,44.5
  Bottom 0.508: U$21.P$1 95.04,27.5 PM2.3
ZX0  (via drill 0.35)
  Top 0.254: U1.P$22 45.05,39.05 arc90 v45.7,38.4
  Top 0.61: JP4.3 98.97,18.05 arc90 U$17.P$1
  Bottom 0.254: v45.7,38.4 48,38.4
  Bottom 0.508: 48,38.4 64.86,38.4 arc-90 67.4,35.86 67.4,19.99 arc90 69.34,18.05 JP4.3 95.03,18.08 U$17.P$1
ZX1  (via drill 0.35)
  Top 0.254: U1.P$23 45.55,40.65 arc90 v46.4,39.8
  Top 0.61: JP4.2 98.97,20.59 arc90 U$16.P$1
  Bottom 0.254: 48,39.8 v46.4,39.8
  Bottom 0.508: 48,39.8 67.8,39.8 arc-90 70.2,37.4 70.2,23.13 arc90 72.74,20.59 JP4.2 95.03,20.62 U$16.P$1
ZX2  (via drill 0.35)
  Top 0.254: v47.2,41.1 46.4,41.1 arc-90 46.05,41.45 U1.P$24
  Top 0.61: JP4.1 98.97,23.13 arc90 U$15.P$1
  Bottom 0.254: v47.2,41.1 48,41.1
  Bottom 0.508: 48,41.1 70.06,41.1 arc-90 72.6,38.56 72.6,25.67 arc90 75.14,23.13 JP4.1 95.03,23.16 U$15.P$1

### Text on the board
tNames: VDD | GND | ATM90E36A | Giuliano Motter | 3V3 ISO | 1V8 | GND ISO | 3V3 | RST | SDI | SDO | 5V | CLK | CS | 3v3 | GND | IRQ1 | GND | IRQ0 | 16.384MHz | WARN | ZX2 | ZX1 | ZX0 | GND | + | - | + | - | + | - | + | - | VA | VB | VC | VN
bNames: Pull-Up / (DMA Mode) | Pull-Down / (SPI Mode)